# EAGLE design cable-direct-adapter (EAGLE 7.3.0)
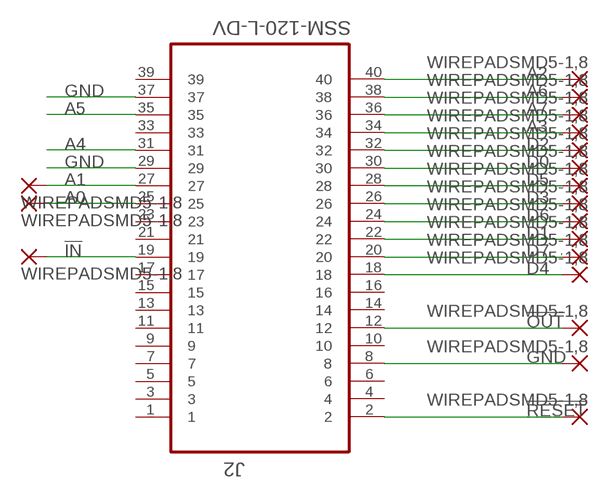
[diagram p0: schematic, sheet 1]

## Parts
J2  SSM-120-L-DV  [SAMTEC_SSM-120-L-DV]
PAD1  WIREPADSMD5-1,8  [5-1,8]
PAD2  WIREPADSMD5-1,8  [5-1,8]
PAD3  WIREPADSMD5-1,8  [5-1,8]
PAD4  WIREPADSMD5-1,8  [5-1,8]
PAD5  WIREPADSMD5-1,8  [5-1,8]
PAD6  WIREPADSMD5-1,8  [5-1,8]
PAD7  WIREPADSMD5-1,8  [5-1,8]
PAD8  WIREPADSMD5-1,8  [5-1,8]
PAD9  WIREPADSMD5-1,8  [5-1,8]
PAD10  WIREPADSMD5-1,8  [5-1,8]
PAD11  WIREPADSMD5-1,8  [5-1,8]
PAD12  WIREPADSMD5-1,8  [5-1,8]
PAD13  WIREPADSMD5-1,8  [5-1,8]
PAD14  WIREPADSMD5-1,8  [5-1,8]
PAD15  WIREPADSMD5-1,8  [5-1,8]
PAD16  WIREPADSMD5-1,8  [5-1,8]
PAD17  WIREPADSMD5-1,8  [5-1,8]
PAD18  WIREPADSMD5-1,8  [5-1,8]

## Nets
!IN: J2.19 PAD18.1(P)
!OUT: J2.12 PAD13.1(P)
!RESET: J2.2 PAD15.1(P)
A0: J2.25 PAD17.1(P)
A1: J2.27 PAD16.1(P)
A2: J2.40 PAD1.1(P)
A3: J2.34 PAD4.1(P)
A4: J2.31
A5: J2.35
A6: J2.38 PAD2.1(P)
A7: J2.36 PAD3.1(P)
D0: J2.30 PAD6.1(P)
D1: J2.22 PAD10.1(P)
D2: J2.32 PAD5.1(P)
D3: J2.26 PAD8.1(P)
D4: J2.18 PAD12.1(P)
D5: J2.28 PAD7.1(P)
D6: J2.24 PAD9.1(P)
D7: J2.20 PAD11.1(P)
GND: J2.8 J2.29 J2.37 PAD14.1(P)
Unconnected: J2.1 J2.3 J2.4 J2.5 J2.6 J2.7 J2.9 J2.10 J2.11 J2.13 J2.14 J2.15 J2.16 J2.17 J2.21 J2.23 J2.33 J2.39

## Library data of the parts
J2 = SAMTEC-FLE-Mxx-Sxx:SSM-120-L-DV: CONN, SOCKET,40WAY, 2ROW ,SMT; MPN: SSM-120-L-DV; OC_FARNELL: 1668272; OC_NEWARK: 11P7981; PACKAGE: SMT,SOCKET, 40WAY, 2ROW; SUPPLIER: SAMTEC
PAD1-PAD18 = wirepad:WIREPAD: Wire PAD connect wire on PCB

## Board
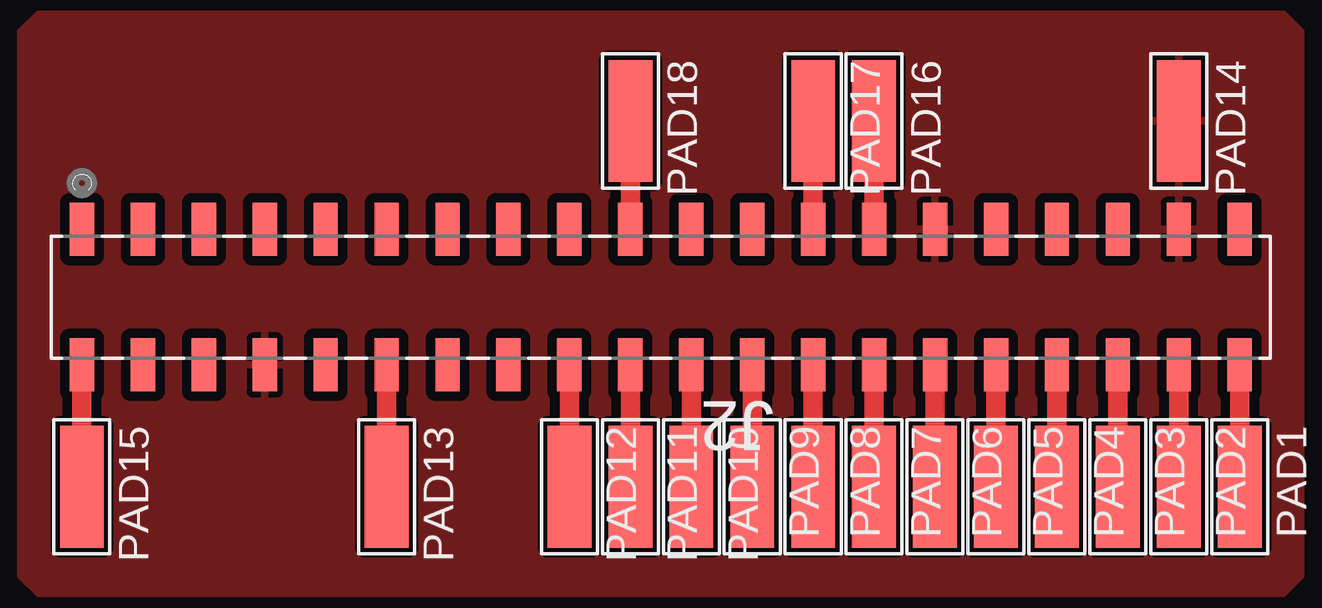
[diagram p1: board, top side]

No outline drawn. Coordinates in mm, seen from the top.
Copper layers (1*16): Top 0.035mm / dielectric 1.5mm / Bottom 0.035mm
Design rules "SparkFun": minimum track width 8mil, minimum drill 20mil, track to track 8mil, track to pad 8mil, pad to pad 8mil, via to via 8mil, smd to smd 8mil, copper to edge 10mil, drill to drill 8mil, minimum pad ring 12mil, minimum via ring 10mil, stop-mask expansion 4mil, vias tented up to drill 25mil, thermal gap 10mil

### Footprints (pad centres in the part's own frame; a part is rotated, then mirrored left to right if it is on the bottom)
SAMTEC_SSM-120-L-DV = smd 1.016 x 2.21: 1 48.26,-5.639; 2 48.26,0; 3 45.72,-5.639; 4 45.72,0; 5 43.18,-5.639; 6 43.18,0; 7 40.64,-5.639; 8 40.64,0; 9 38.1,-5.639; 10 38.1,0; 11 35.56,-5.639; 12 35.56,0; 13 33.02,-5.639; 14 33.02,0; 15 30.48,-5.639; 16 30.48,0; 17 27.94,-5.639; 18 27.94,0; 19 25.4,-5.639; 20 25.4,0; 21 22.86,-5.639; 22 22.86,0; 23 20.32,-5.639; 24 20.32,0; 25 17.78,-5.639; 26 17.78,0; 27 15.24,-5.639; 28 15.24,0; 29 12.7,-5.639; 30 12.7,0; 31 10.16,-5.639; 32 10.16,0; 33 7.62,-5.639; 34 7.62,0; 35 5.08,-5.639; 36 5.08,0; 37 2.54,-5.639; 38 2.54,0; 39 0,-5.639; 40 0,0
5-1,8 = smd 1.829 x 5.08: 1 0,0

### Placement (x,y rotation side)
J2  52.07,11.43 180 top
PAD1  52.07,6.35 180 top
PAD2  49.53,6.35 180 top
PAD3  46.99,6.35 180 top
PAD4  44.45,6.35 180 top
PAD5  41.91,6.35 180 top
PAD6  39.37,6.35 180 top
PAD7  36.83,6.35 180 top
PAD8  34.29,6.35 180 top
PAD9  31.75,6.35 180 top
PAD10  29.21,6.35 180 top
PAD11  26.67,6.35 180 top
PAD12  24.13,6.35 180 top
PAD13  16.51,6.35 180 top
PAD14  49.53,21.59 180 top
PAD15  3.81,6.35 180 top
PAD16  36.83,21.59 180 top
PAD17  34.29,21.59 180 top
PAD18  26.67,21.59 180 top

### Tracks (layer width: path | path; a pad name or v marks a point on that pad's centre or on a via)
!IN
  Top 0.813: J2.19 PAD18.1 26.67,22.86
!OUT
  Top 0.813: J2.12 PAD13.1
!RESET
  Top 0.813: J2.2 PAD15.1
A0
  Top 0.813: J2.25 PAD17.1
A1
  Top 0.813: J2.27 PAD16.1
A2
  Top 0.813: J2.40 PAD1.1 52.07,5.08
A3
  Top 0.813: J2.34 PAD4.1
A6
  Top 0.813: PAD2.1 J2.38
A7
  Top 0.813: PAD3.1 J2.36
D0
  Top 0.813: J2.30 PAD6.1
D1
  Top 0.813: PAD10.1 J2.22
D2
  Top 0.813: PAD5.1 J2.32
D3
  Top 0.813: J2.26 PAD8.1
D4
  Top 0.813: PAD12.1 J2.18
D5
  Top 0.813: PAD7.1 J2.28
D6
  Top 0.813: J2.24 PAD9.1
D7
  Top 0.813: J2.20 PAD11.1
GND
  pour Top (isolate 0.406): 54.61,25.3 54.61,2.63 53.88,1.91 2,1.91 1.27,2.63 1.27,25.3 2,26.04 53.88,26.04